# Altium schematic sheet controller.SchDoc
size A
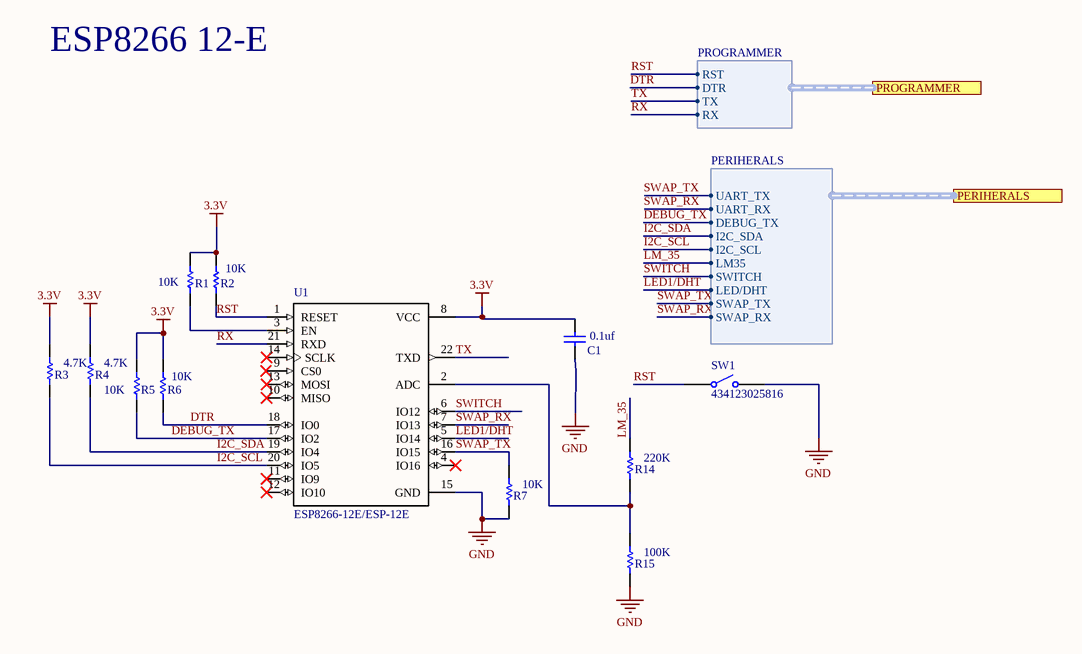
[diagram p0: controller.SchDoc]

## Parts
C1  0.1uf  [CAPC0603]
R1  10K  [RESC0603]
R2  10K  [RESC0603]
R3  4.7K  [RESC0603]
R4  4.7K  [RESC0603]
R5  10K  [RESC0603]
R6  10K  [RESC0603]
R7  10K  [RESC0603]
R14  220K  [RESC0603]
R15  100K  [RESC0603]
SW1  434123025816  [434123025816]
U1  ESP8266-12E/ESP-12E  [*XCVR_ESP8266-12E/ESP-12E]

## Ports
PERIHERALS (harness PERIHERALS), PROGRAMMER (harness PROGRAMMER)

## Harnesses
PROGRAMMER: RST, DTR, TX, RX
PERIHERALS: UART_TX, UART_RX, DEBUG_TX, I2C_SDA, I2C_SCL, LM35, SWITCH, LED/DHT, SWAP_TX, SWAP_RX

## Nets
3.3V: C1.1 R1.2 R2.2 R3.2 R4.2 R5.2 R6.2 U1.8(VCC)
GND: C1.2 R7.1 R15.1 SW1.2 U1.15(GND)
DEBUG_TX: R5.1 U1.17(IO2) ; port PERIHERALS.DEBUG_TX
DTR: R6.1 U1.18(IO0) ; port PROGRAMMER.DTR
I2C_SCL: R3.1 U1.20(IO5) ; port PERIHERALS.I2C_SCL
I2C_SDA: R4.1 U1.19(IO4) ; port PERIHERALS.I2C_SDA
LED1/DHT: U1.5(IO14) ; port PERIHERALS.LED/DHT
LM_35: R14.2 ; port PERIHERALS.LM35
RST: R2.1 SW1.1 U1.1(RESET) ; port PROGRAMMER.RST
RX: U1.21(RXD) ; port PROGRAMMER.RX
SWAP_RX: U1.7(IO13) ; port PERIHERALS.SWAP_RX
SWAP_TX: R7.2 U1.16(IO15) ; port PERIHERALS.SWAP_TX
SWITCH: U1.6(IO12) ; port PERIHERALS.SWITCH
TX: U1.22(TXD) ; port PROGRAMMER.TX
NetR1_1: R1.1 U1.3(EN)
NetR14_1: R14.1 R15.2 U1.2(ADC)

Not connected (* = marked no-connect by the designer): U1 4(IO16)* 9(CS0) 10(MISO)* 11(IO9)* 12(IO10)* 13(MOSI)* 14(SCLK)*

## Notes on the sheet
- ESP8266 12-E
- Labels drawn without touching a wire or pin: SWAP_RX, SWAP_TX

## Library data of the parts
C1 = CMP-2007-04765-1: Part Number: 08055C104KAJ2A; Manufacturer: AVX Interconnect / Elco
R1-R7 R14 R15 = CMP-1013-00215-1: 2R55 0.125W 1% 0805 (2012 Metric)  SMD; Case-Metric: 2012; Value: 2.55 Ohm; Case-EIA: 0805; Tolerance: 1 %; Technology: SMT; Power: 0.125 W
SW1 = CMP-1460-00004-1: WS-TASV J-Bend SMD Tact Switch 6.0X3.8 mm; Manufacturer: Wuerth Elektronik; NoPins: 02; ComponentLink2Description: Datasheet; ComponentLink2URL: http://katalog.we-online.de/em/datasheet/434123025816.pdf; ComponentLink1URL: http://www.we-online.com; PartNumber: 434123025816; PackageReference: 434123025816; ComponentLink1Description: Manufacturer URL
U1 = ESP8266-12E/ESP-12E: This WiFi module has a 32-bit MCU micro and clock speeds supporting 80 MHz or 160 MHz. Supports the RTOS and integrated Wi-Fi MAC/BB/RF/PA/LNA, and has an on-board antenna.; MF: AI-Thinker; Availability: Unavailable; MP: ESP8266-12E/ESP-12E; Price: None; SnapEDA_Link: https://www.snapeda.com/parts/ESP8266-12E/ESP-12E/AI-Thinker/view-part/?ref=snap; Package: None; Value: *